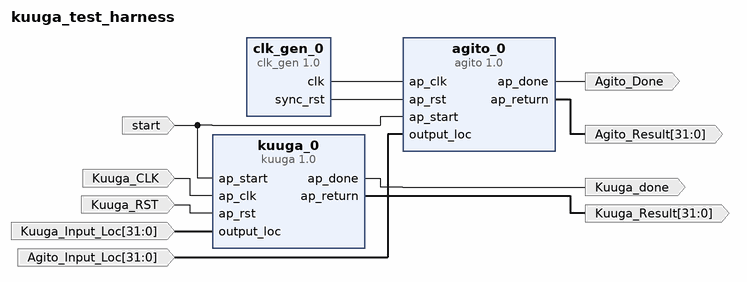
[diagram p0: block diagram of the top level]
# Vivado block design kuuga_test_harness, Vivado 2015.4
create_bd_design kuuga_test_harness

create_bd_port -dir I start
create_bd_port -dir O Kuuga_done
create_bd_port -dir O -from 31 -to 0 -type data Kuuga_Result
create_bd_port -dir I -type clk Kuuga_CLK
set_property -dict {CONFIG.FREQ_HZ 100000000} [get_bd_ports Kuuga_CLK]
create_bd_port -dir I -type rst Kuuga_RST
set_property -dict {CONFIG.POLARITY ACTIVE_HIGH} [get_bd_ports Kuuga_RST]
create_bd_port -dir I -from 31 -to 0 -type data Kuuga_Input_Loc
create_bd_port -dir I -from 31 -to 0 -type data Agito_Input_Loc
create_bd_port -dir O -type data Agito_Done
create_bd_port -dir O -from 31 -to 0 -type data Agito_Result

create_bd_cell -type ip -vlnv xilinx.com:hls:kuuga:1.0 kuuga_0
create_bd_cell -type ip -vlnv xilinx.com:hls:agito:1.0 agito_0
create_bd_cell -type ip -vlnv xilinx.com:ip:clk_gen:1.0 clk_gen_0
set_property -dict {CONFIG.INITIAL_RESET_CLOCK_CYCLES 250 CONFIG.RESET_POLARITY ACTIVE_HIGH} [get_bd_cells clk_gen_0]

# ---- connections ----

connect_bd_net [get_bd_ports start] [get_bd_pins kuuga_0/ap_start] [get_bd_pins agito_0/ap_start]
connect_bd_net [get_bd_pins kuuga_0/ap_done] [get_bd_ports Kuuga_done]
connect_bd_net [get_bd_pins kuuga_0/ap_return] [get_bd_ports Kuuga_Result]
connect_bd_net -net CLK_1 [get_bd_ports Kuuga_CLK] [get_bd_pins kuuga_0/ap_clk]
connect_bd_net -net RST_1 [get_bd_ports Kuuga_RST] [get_bd_pins kuuga_0/ap_rst]
connect_bd_net -net input_location_1 [get_bd_ports Kuuga_Input_Loc] [get_bd_pins kuuga_0/output_loc]
connect_bd_net [get_bd_ports Agito_Input_Loc] [get_bd_pins agito_0/output_loc]
connect_bd_net [get_bd_pins agito_0/ap_done] [get_bd_ports Agito_Done]
connect_bd_net [get_bd_pins agito_0/ap_return] [get_bd_ports Agito_Result]
connect_bd_net [get_bd_pins clk_gen_0/clk] [get_bd_pins agito_0/ap_clk]
connect_bd_net [get_bd_pins clk_gen_0/sync_rst] [get_bd_pins agito_0/ap_rst]

validate_bd_design
save_bd_design
